# EAGLE board Specialist (EAGLE 6.4)
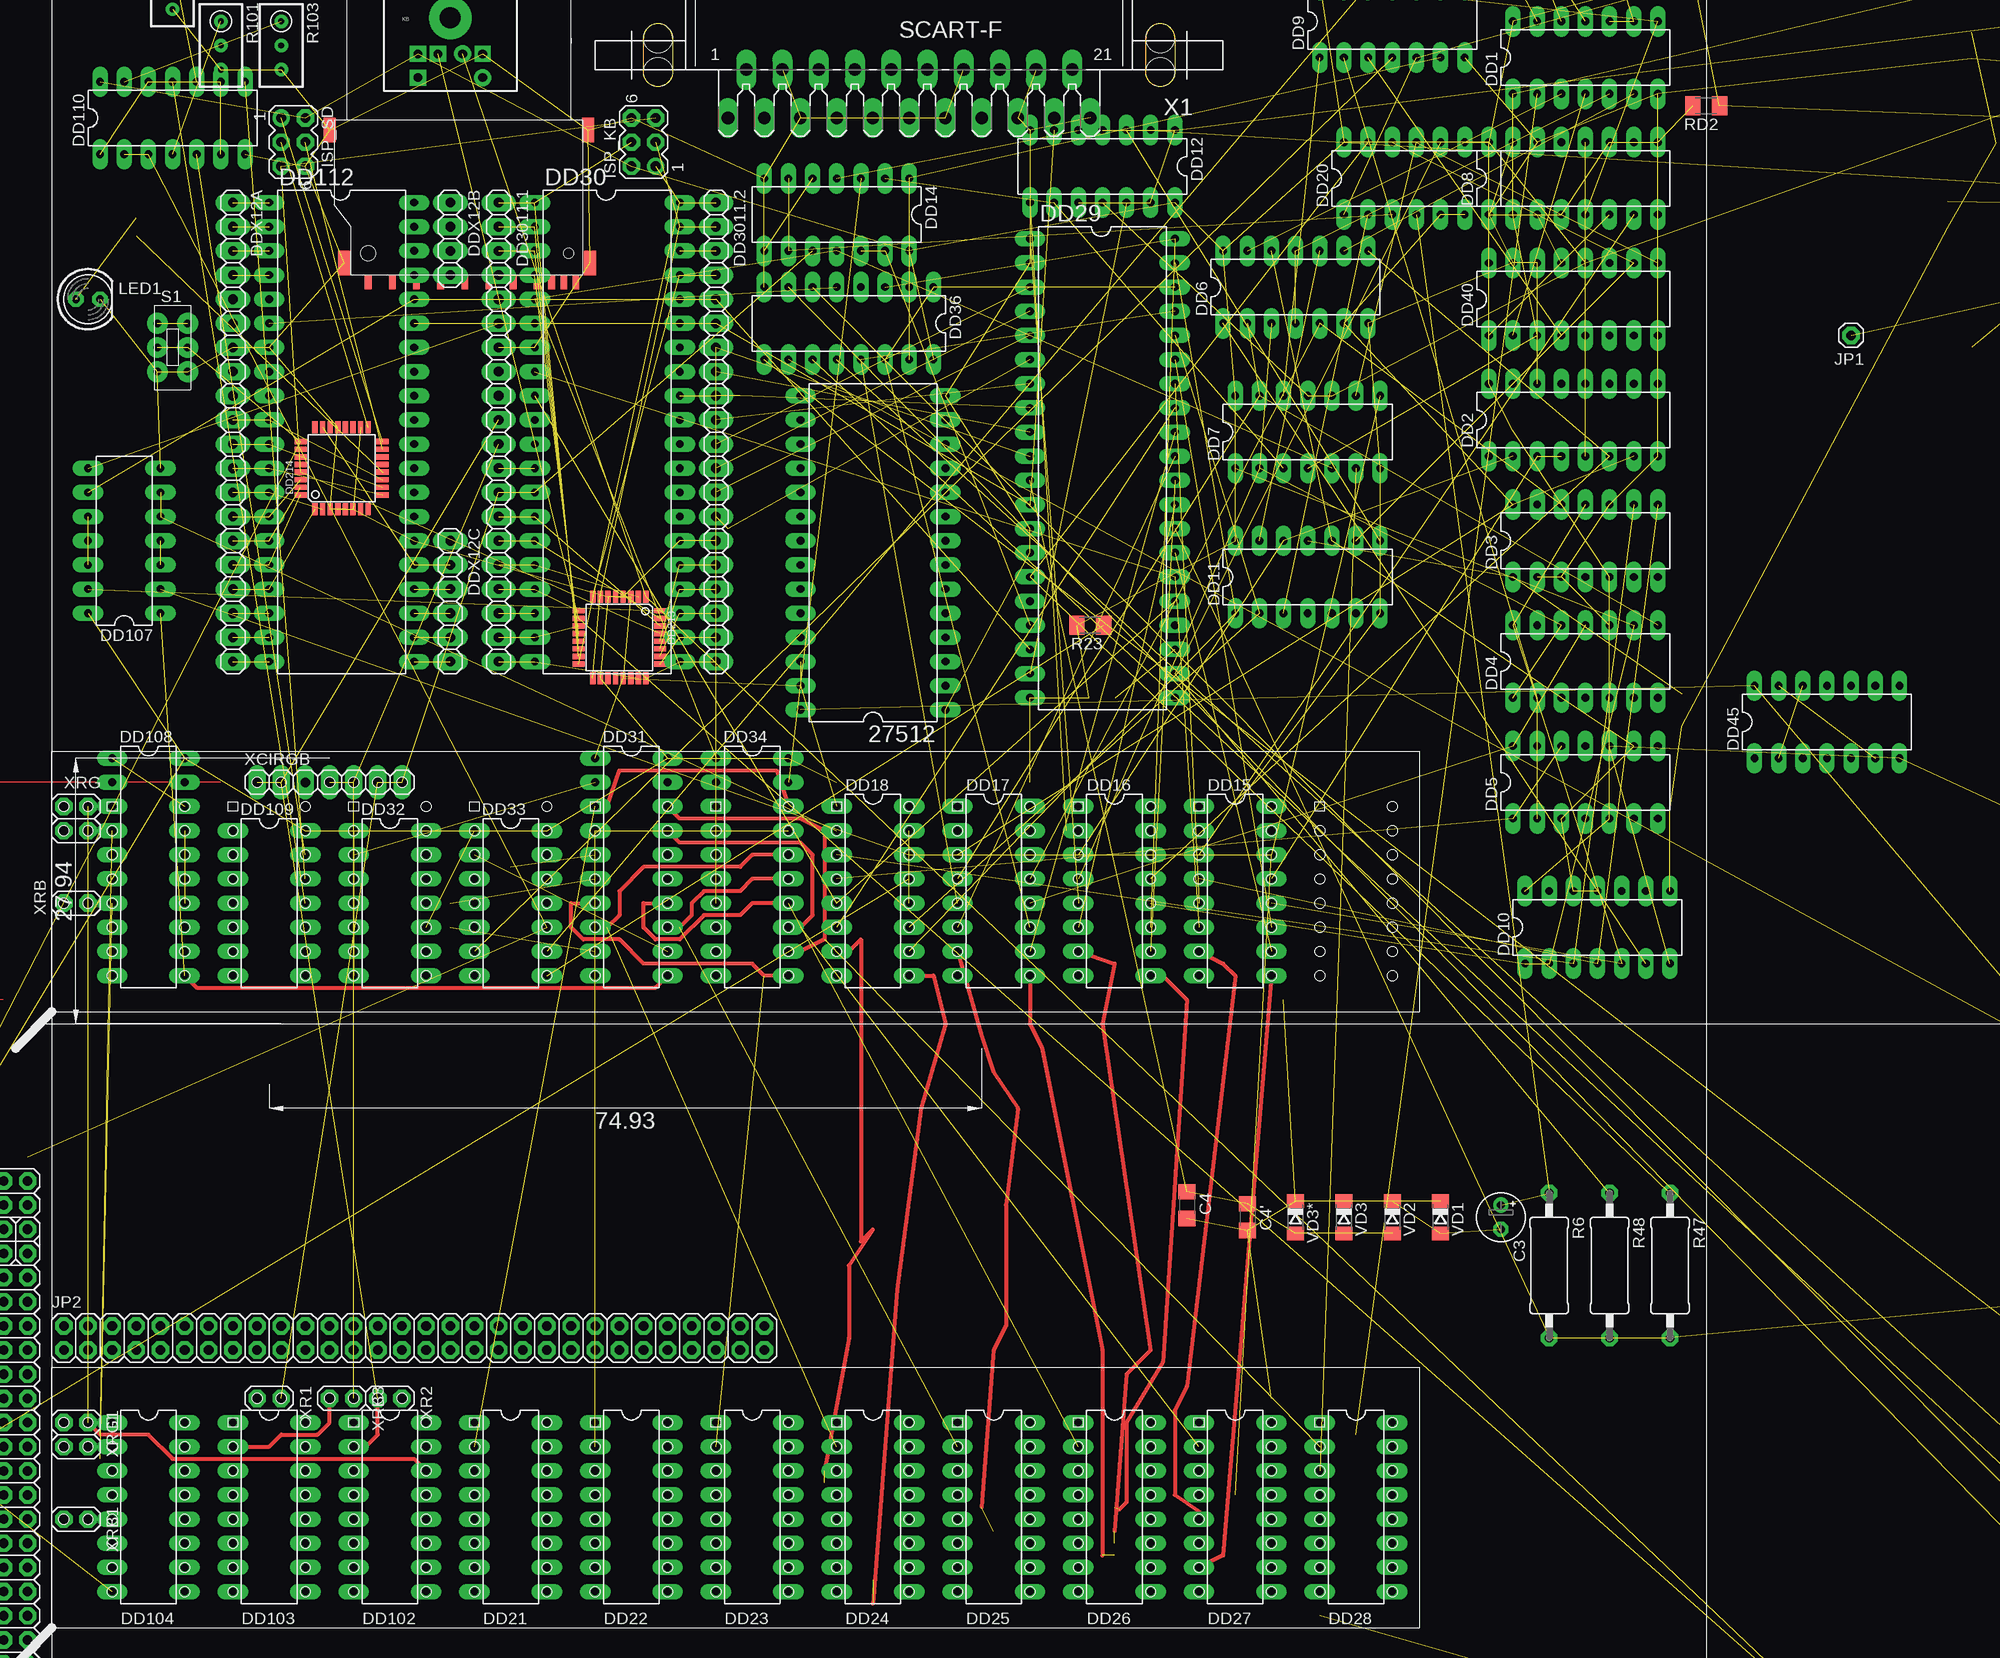
[diagram p9: board, top side]
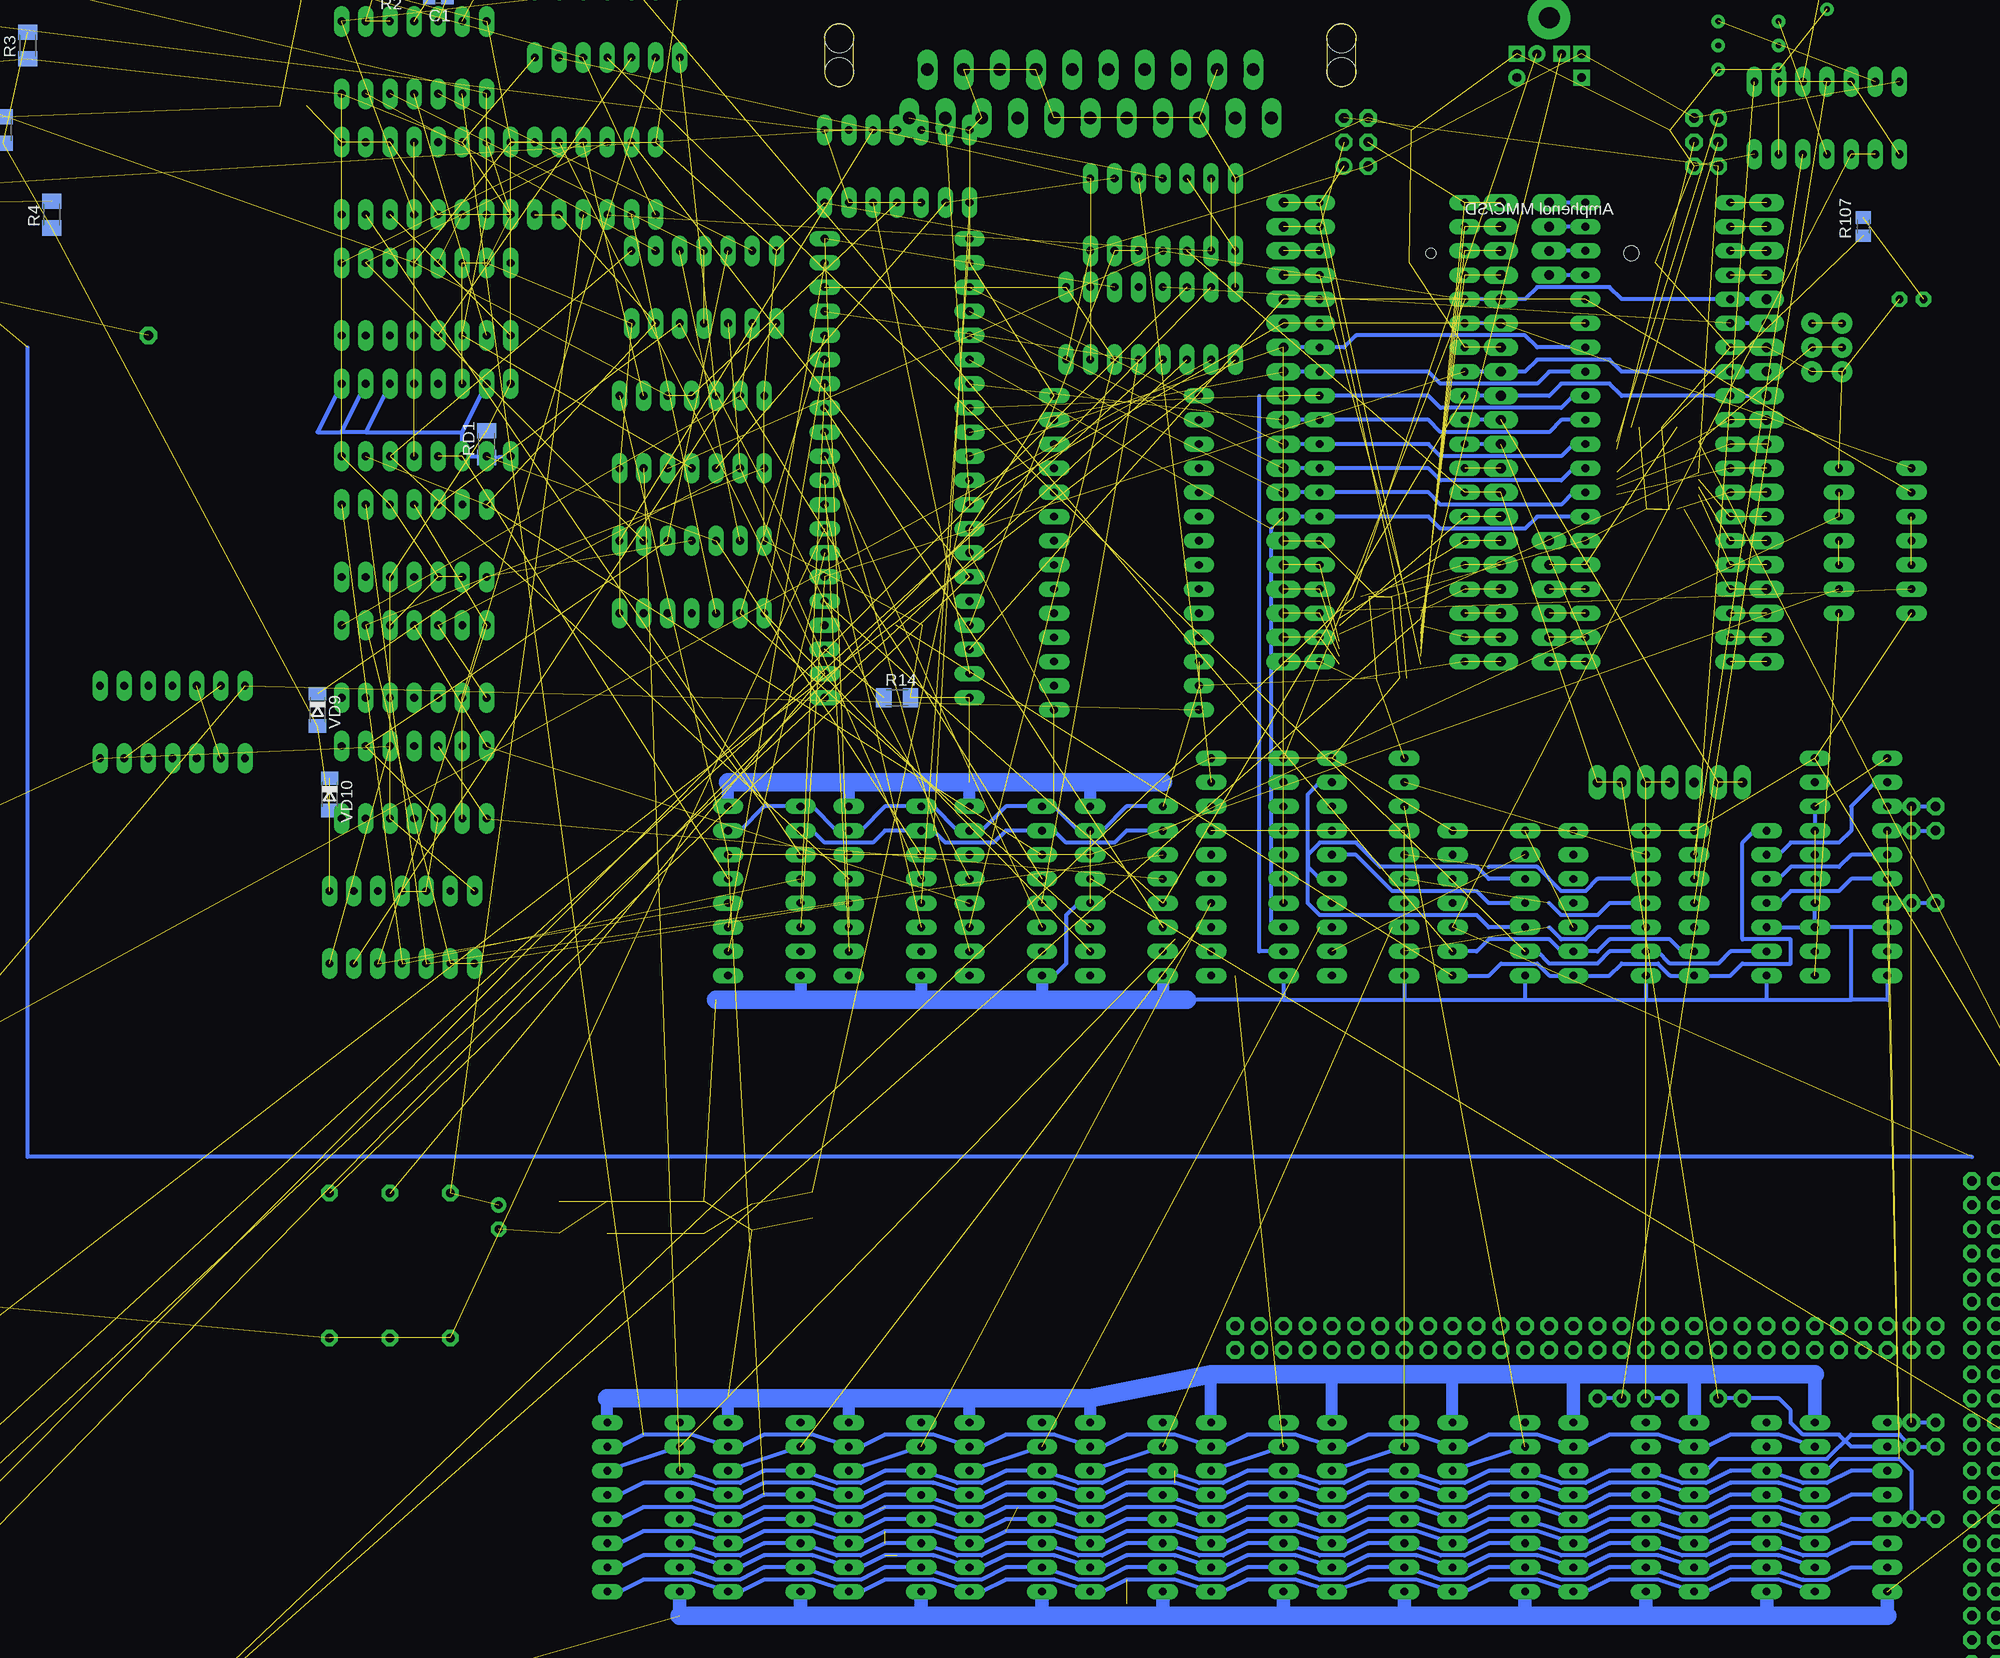
[diagram p10: board, bottom side, seen from below]

Size 55.88 x 6.6 mm. Coordinates in mm from the lower left corner, seen from the top.
Copper layers (1*16): Top 0.035mm / dielectric 1.5mm / Bottom 0.035mm
Design rules "speccy2007": minimum track width 10mil, minimum drill 24mil, track to track 8mil, track to pad 8mil, pad to pad 8mil, via to via 8mil, smd to smd 8mil, copper to edge 40mil, drill to drill 7mil, minimum pad ring 0.4mm, minimum via ring 8mil, stop-mask expansion 4mil, vias tented up to drill 0mil, thermal gap 10mil

## Footprints (pad centres in the part's own frame; a part is rotated, then mirrored left to right if it is on the bottom)
DIL28 = drill 0.813 long: 1 -16.51,-7.62; 2 -13.97,-7.62; 3 -11.43,-7.62; 4 -8.89,-7.62; 5 -6.35,-7.62; 6 -3.81,-7.62; 7 -1.27,-7.62; 8 1.27,-7.62; 9 3.81,-7.62; 10 6.35,-7.62; 11 8.89,-7.62; 12 11.43,-7.62; 13 13.97,-7.62; 14 16.51,-7.62; 15 16.51,7.62; 16 13.97,7.62; 17 11.43,7.62; 18 8.89,7.62; 19 6.35,7.62; 20 3.81,7.62; 21 1.27,7.62; 22 -1.27,7.62; 23 -3.81,7.62; 24 -6.35,7.62; 25 -8.89,7.62; 26 -11.43,7.62; 27 -13.97,7.62; 28 -16.51,7.62
C0805 = smd 1.3 x 1.5: 1 -0.95,0; 2 0.95,0
E2,5-5 = drill 0.813 pad 1.6: + -1.27,0 | drill 0.813 pad 1.6 octagon: - 1.27,0
C1206 = smd 1.6 x 1.8: 1 -1.4,0; 2 1.4,0
DIL14 = drill 0.813 long: 1 -7.62,-3.81; 2 -5.08,-3.81; 3 -2.54,-3.81; 4 0,-3.81; 5 2.54,-3.81; 6 5.08,-3.81; 7 7.62,-3.81; 8 7.62,3.81; 9 5.08,3.81; 10 2.54,3.81; 11 0,3.81; 12 -2.54,3.81; 13 -5.08,3.81; 14 -7.62,3.81
DIL16 = drill 0.813 long: 1 -8.89,-3.81; 2 -6.35,-3.81; 3 -3.81,-3.81; 4 -1.27,-3.81; 5 1.27,-3.81; 6 3.81,-3.81; 7 6.35,-3.81; 8 8.89,-3.81; 9 8.89,3.81; 10 6.35,3.81; 11 3.81,3.81; 12 1.27,3.81; 13 -1.27,3.81; 14 -3.81,3.81; 15 -6.35,3.81; 16 -8.89,3.81
DIL40 = drill 0.813 long: 1 -24.13,-7.62; 2 -21.59,-7.62; 3 -19.05,-7.62; 4 -16.51,-7.62; 5 -13.97,-7.62; 6 -11.43,-7.62; 7 -8.89,-7.62; 8 -6.35,-7.62; 9 -3.81,-7.62; 10 -1.27,-7.62; 11 1.27,-7.62; 12 3.81,-7.62; 13 6.35,-7.62; 14 8.89,-7.62; 15 11.43,-7.62; 16 13.97,-7.62; 17 16.51,-7.62; 18 19.05,-7.62; 19 21.59,-7.62; 20 24.13,-7.62; 21 24.13,7.62; 22 21.59,7.62; 23 19.05,7.62; 24 16.51,7.62; 25 13.97,7.62; 26 11.43,7.62; 27 8.89,7.62; 28 6.35,7.62; 29 3.81,7.62; 30 1.27,7.62; 31 -1.27,7.62; 32 -3.81,7.62; 33 -6.35,7.62; 34 -8.89,7.62; 35 -11.43,7.62; 36 -13.97,7.62; 37 -16.51,7.62; 38 -19.05,7.62; 39 -21.59,7.62; 40 -24.13,7.62
DIL20 = drill 0.813 long: 1 -11.43,-3.81; 2 -8.89,-3.81; 3 -6.35,-3.81; 4 -3.81,-3.81; 5 -1.27,-3.81; 6 1.27,-3.81; 7 3.81,-3.81; 8 6.35,-3.81; 9 8.89,-3.81; 10 11.43,-3.81; 11 11.43,3.81; 12 8.89,3.81; 13 6.35,3.81; 14 3.81,3.81; 15 1.27,3.81; 16 -1.27,3.81; 17 -3.81,3.81; 18 -6.35,3.81; 19 -8.89,3.81; 20 -11.43,3.81
DIL24 = drill 0.813 long: 1 -13.97,-7.62; 2 -11.43,-7.62; 3 -8.89,-7.62; 4 -6.35,-7.62; 5 -3.81,-7.62; 6 -1.27,-7.62; 7 1.27,-7.62; 8 3.81,-7.62; 9 6.35,-7.62; 10 8.89,-7.62; 11 11.43,-7.62; 12 13.97,-7.62; 13 13.97,7.62; 14 11.43,7.62; 15 8.89,7.62; 16 6.35,7.62; 17 3.81,7.62; 18 1.27,7.62; 19 -1.27,7.62; 20 -3.81,7.62; 21 -6.35,7.62; 22 -8.89,7.62; 23 -11.43,7.62; 24 -13.97,7.62
TQFP32-08 = smd 1.27 x 0.559: 1 -4.293,2.8; 2 -4.293,2; 3 -4.293,1.2; 4 -4.293,0.4; 5 -4.293,-0.4; 6 -4.293,-1.2; 7 -4.293,-2; 8 -4.293,-2.8; 17 4.293,-2.8; 18 4.293,-2; 19 4.293,-1.2; 20 4.293,-0.4; 21 4.293,0.4; 22 4.293,1.2; 23 4.293,2; 24 4.293,2.8 | smd 0.559 x 1.27: 9 -2.8,-4.293; 10 -2,-4.293; 11 -1.2,-4.293; 12 -0.4,-4.293; 13 0.4,-4.293; 14 1.2,-4.293; 15 2,-4.293; 16 2.8,-4.293; 25 2.8,4.293; 26 2,4.293; 27 1.2,4.293; 28 0.4,4.293; 29 -0.4,4.293; 30 -1.2,4.293; 31 -2,4.293; 32 -2.8,4.293
1X20 = drill 1.016 long: 1 -24.13,0; 2 -21.59,0; 3 -19.05,0; 4 -16.51,0; 5 -13.97,0; 6 -11.43,0; 7 -8.89,0; 8 -6.35,0; 9 -3.81,0; 10 -1.27,0; 11 1.27,0; 12 3.81,0; 13 6.35,0; 14 8.89,0; 15 11.43,0; 16 13.97,0; 17 16.51,0; 18 19.05,0; 19 21.59,0; 20 24.13,0
1X04 = drill 1.016 long: 1 -3.81,0; 2 -1.27,0; 3 1.27,0; 4 3.81,0
1X06 = drill 1.016 long: 1 -6.35,0; 2 -3.81,0; 3 -1.27,0; 4 1.27,0; 5 3.81,0; 6 6.35,0
MA03-2 = drill 1.016: 1 -2.54,-1.27 | drill 1.016 octagon: 2 -2.54,1.27; 3 0,-1.27; 4 0,1.27; 5 2.54,-1.27; 6 2.54,1.27
SDCMF-10915W010 = smd 0.711 x 1.422: 1 7.366,13.462; 2 4.826,13.462; 3 2.286,13.462; 4 -0.254,13.462; 5 -2.794,13.462; 6 -5.334,13.462; 7 -7.874,13.462; 8 -9.398,13.462; 9 9.906,13.462; 10 -11.938,13.462; 11 -10.668,13.462 | smd 1.27 x 2.54: M1 12.43,11.43; M2 13.97,-2.54; M3 -13.208,-2.54; M4 -13.446,11.43 | hole 1.6: 9.906,10.414 | hole 1.1: -11.176,10.414
1X01 = drill 1.016 octagon: 1 0,0
2X30 = drill 1.016 octagon: 1 -38.1,-1.27; 2 -38.1,1.27; 3 -35.56,-1.27; 4 -35.56,1.27; 5 -33.02,-1.27; 6 -33.02,1.27; 7 -30.48,-1.27; 8 -30.48,1.27; 9 -27.94,-1.27; 10 -27.94,1.27; 11 -25.4,-1.27; 12 -25.4,1.27; 13 -22.86,-1.27; 14 -22.86,1.27; 15 -20.32,-1.27; 16 -20.32,1.27; 17 -17.78,-1.27; 18 -17.78,1.27; 19 -15.24,-1.27; 20 -15.24,1.27; 21 -12.7,-1.27; 22 -12.7,1.27; 23 -10.16,-1.27; 24 -10.16,1.27; 25 -7.62,-1.27; 26 -7.62,1.27; 27 -5.08,-1.27; 28 -5.08,1.27; 29 -2.54,-1.27; 30 -2.54,1.27; 31 0,-1.27; 32 0,1.27; 33 2.54,-1.27; 34 2.54,1.27; 35 5.08,-1.27; 36 5.08,1.27; 37 7.62,-1.27; 38 7.62,1.27; 39 10.16,-1.27; 40 10.16,1.27; 41 12.7,-1.27; 42 12.7,1.27; 43 15.24,-1.27; 44 15.24,1.27; 45 17.78,-1.27; 46 17.78,1.27; 47 20.32,-1.27; 48 20.32,1.27; 49 22.86,-1.27; 50 22.86,1.27; 51 25.4,-1.27; 52 25.4,1.27; 53 27.94,-1.27; 54 27.94,1.27; 55 30.48,-1.27; 56 30.48,1.27; 57 33.02,-1.27; 58 33.02,1.27; 59 35.56,-1.27; 60 35.56,1.27
2X03 = drill 1.016 octagon: 1 -2.54,-1.27; 2 -2.54,1.27; 3 0,-1.27; 4 0,1.27; 5 2.54,-1.27; 6 2.54,1.27
MINI-DIN6 = drill 0.9 pad 1.676 square: 1 -1.3,-8.5; 3 -3.4,-8.5; 4 3.4,-8.5; 5 -3.4,-11 | drill 0.9 pad 1.778: 2 1.3,-8.5; 6 3.4,-11 | drill 2.2 pad 4.5: GND 0,-4.7
LED5MM = drill 0.813 octagon: A -1.27,0; K 1.27,0
M1206 = smd 1.6 x 2: 1 -1.4,0; 2 1.4,0
0411/15 = drill 0.914 octagon: 1 -7.62,0; 2 7.62,0
M0805 = smd 1.3 x 1.6: 1 -0.95,0; 2 0.95,0
RTRIM3296W = drill 0.61: 1 0,-2.54; 2 0,0; 3 0,2.54
SWITCH9X4 = drill 0.8 pad 2.184: 10 -1.587,0; 11 -1.587,2.54; 12 -1.587,-2.54; 20 1.587,0; 21 1.587,2.54; 22 1.587,-2.54
NANOITXPCB = hole 3.8: 3.25,116.75; 113.65,86.95; 116.75,3; 2.75,3
SOD80C = smd 1.4 x 1.8: A 1.7,0; C -1.7,0
DO41-10 = drill 1.118: A 5.08,0; C -5.08,0
SCART-F = drill 1.321 long: 1 19.05,5.08; 2 17.145,0; 3 15.24,5.08; 4 13.335,0; 5 11.43,5.08; 6 9.525,0; 7 7.62,5.08; 8 5.715,0; 9 3.81,5.08; 10 1.905,0; 11 0,5.08; 12 -1.905,0; 13 -3.81,5.08; 14 -5.715,0; 15 -7.62,5.08; 16 -9.525,0; 17 -11.43,5.08; 18 -13.335,0; 19 -15.24,5.08; 20 -17.145,0; 21 -19.05,5.08 | hole 3.023: 26.416,0.254; 26.416,-3.302; -26.416,0.254; -26.416,-3.302
1X07 = drill 1.016 long: 1 -7.62,0; 2 -5.08,0; 3 -2.54,0; 4 0,0; 5 2.54,0; 6 5.08,0; 7 7.62,0
2X01 = drill 1.016 octagon: 1 -1.27,-1.27; 2 -1.27,1.27
2X02 = drill 1.016 octagon: 1 -1.27,-1.27; 2 -1.27,1.27; 3 1.27,-1.27; 4 1.27,1.27
HC49/S = drill 0.813: 1 -2.413,0; 2 2.413,0

## Placement (x,y rotation side)
27512  [DIL28]  24.13,-49.02 90 top  (outside the outline)
C1  300  [C0805]  96.52,9.4 180 bottom  (outside the outline)
C3  2m2  [E2,5-5]  90.17,-118.87 270 top  (outside the outline)
C4  [C1206]  57.15,-117.6 270 top  (outside the outline)
C4'  [C1206]  63.5,-118.87 270 top  (outside the outline)
C5  100  [C0805]  154.94,1.78 0 bottom  (outside the outline)
C6  68  [C0805]  154.94,14.48 0 bottom  (outside the outline)
C7  100m  [E2,5-5]  156.21,-10.92 0 top  (outside the outline)
C10  2m2  [E2,5-5]  148.59,-21.08 0 top  (outside the outline)
C11  22n  [C0805]  147.32,-12.19 0 top  (outside the outline)
DD1  К155ЛН1  [DIL14]  99.06,3.05 0 top  (outside the outline)
DD2  К155ИЕ7  [DIL16]  97.79,-35.05 0 top  (outside the outline)
DD3  К155ИЕ5  [DIL14]  99.06,-47.75 0 top  (outside the outline)
DD4  К155ИЕ5  [DIL14]  99.06,-60.45 0 top  (outside the outline)
DD5  К155ИЕ5  [DIL14]  99.06,-73.15 0 top  (outside the outline)
DD6  К155ЛЕ1  [DIL14]  68.58,-21.08 0 top  (outside the outline)
DD7  К155ЛА4  [DIL14]  69.85,-36.32 0 top  (outside the outline)
DD8  К155ИЕ7  [DIL16]  97.79,-9.65 0 top  (outside the outline)
DD9  К155ЛН1  [DIL14]  78.74,6.86 0 top  (outside the outline)
DD10  К155ЛА2  [DIL14]  100.33,-88.39 0 top  (outside the outline)
DD11  К155ЛА3  [DIL14]  69.85,-51.56 0 top  (outside the outline)
DD12  К155ТМ2  [DIL14]  48.26,-8.38 180 top  (outside the outline)
DD14  К155ЛА3  [DIL14]  20.32,-13.46 180 top  (outside the outline)
DD15  К155КП2  [DIL16]  62.23,-84.58 270 top  (outside the outline)
DD16  К155КП2  [DIL16]  49.53,-84.58 270 top  (outside the outline)
DD17  К155КП2  [DIL16]  36.83,-84.58 270 top  (outside the outline)
DD18  К155КП2  [DIL16]  24.13,-84.58 270 top  (outside the outline)
DD19  К155ЛП10  [DIL16]  219.71,-150.62 180 top  (outside the outline)
DD20  К155ЛА8  [DIL14]  81.28,-9.65 0 top  (outside the outline)
DD21  КР565РУ5  [DIL16]  -13.97,-149.35 270 top  (outside the outline)
DD22  КР565РУ5  [DIL16]  -1.27,-149.35 270 top  (outside the outline)
DD23  КР565РУ5  [DIL16]  11.43,-149.35 270 top  (outside the outline)
DD24  КР565РУ5  [DIL16]  24.13,-149.35 270 top  (outside the outline)
DD25  КР565РУ5  [DIL16]  36.83,-149.35 270 top  (outside the outline)
DD26  КР565РУ5  [DIL16]  49.53,-149.35 270 top  (outside the outline)
DD27  КР565РУ5  [DIL16]  62.23,-149.35 270 top  (outside the outline)
DD28  КР565РУ5  [DIL16]  74.93,-149.35 270 top  (outside the outline)
DD29  КР580ВМ80  [DIL40]  48.26,-40.13 270 top  (outside the outline)
DD30  КР580ВВ55  [DIL40]  -3.81,-36.32 270 top  (outside the outline)
DD31  К555ИР22  [DIL20]  -1.27,-82.04 270 top  (outside the outline)
DD32  К555ИР16  [DIL14]  -26.67,-85.85 270 top  (outside the outline)
DD33  К555ИР16  [DIL14]  -13.97,-85.85 270 top  (outside the outline)
DD34  К555АП6  [DIL20]  11.43,-82.04 270 top  (outside the outline)
DD36  К155ИД4  [DIL16]  21.59,-24.89 180 top  (outside the outline)
DD37  К573РФ2  [DIL24]  171.45,-141.73 90 top  (outside the outline)
DD38  К573РФ2  [DIL24]  173.99,-107.44 90 top  (outside the outline)
DD39  К573РФ4  [DIL28]  194.31,-141.73 270 top  (outside the outline)
DD40  К155ИД4  [DIL16]  97.79,-22.35 0 top  (outside the outline)
DD45  К555ИЕ19  [DIL14]  124.46,-66.8 0 top  (outside the outline)
DD102  КР565РУ5  [DIL16]  -26.67,-149.35 270 top  (outside the outline)
DD103  КР565РУ5  [DIL16]  -39.37,-149.35 270 top  (outside the outline)
DD104  КР565РУ5  [DIL16]  -52.07,-149.35 270 top  (outside the outline)
DD107  К155ЛЕ1  [DIL14]  -54.61,-47.75 90 top  (outside the outline)
DD108  К555ИР22  [DIL20]  -52.07,-82.04 270 top  (outside the outline)
DD109  К555ИР16  [DIL14]  -39.37,-85.85 270 top  (outside the outline)
DD110  К155ЛЕ1  [DIL14]  -49.53,-3.3 0 top  (outside the outline)
DD112  КР580ВВ55  [DIL40]  -31.75,-36.32 270 top  (outside the outline)
DD213  MEGA8-AI  [TQFP32-08]  -2.54,-57.91 270 top  (outside the outline)
DD214  MEGA8-AI  [TQFP32-08]  -31.75,-40.13 90 top  (outside the outline)
DD3011.1  [1X20]  -15.24,-36.32 270 top  (outside the outline)
DD3011.2  [1X20]  7.62,-36.32 270 top  (outside the outline)
DDX12A  [1X20]  -43.18,-36.32 270 top  (outside the outline)
DDX12B  [1X04]  -20.32,-16 270 top  (outside the outline)
DDX12C  [1X06]  -20.32,-54.1 270 top  (outside the outline)
ISP_KB  [MA03-2]  0,-5.84 90 top  (outside the outline)
ISP_SD  [MA03-2]  -36.83,-5.84 270 top  (outside the outline)
J1  [SDCMF-10915W010]  -19.05,-7.11 180 top  (outside the outline)
JP1  [1X01]  127,-26.16 180 top  (outside the outline)
JP2  [2X30]  -22.86,-131.57 0 top  (outside the outline)
JP4  [2X30]  -66.04,-150.62 90 top  (outside the outline)
JP8  [2X03]  -67.31,-121.41 0 top  (outside the outline)
KB  MINI-DIN6  [MINI-DIN6]  -20.32,11.94 0 top  (outside the outline)
LED1  [LED5MM]  -58.42,-22.35 0 top  (outside the outline)
R1  390  [M1206]  92.71,11.94 180 bottom  (outside the outline)
R2  390  [M1206]  101.6,10.67 180 bottom  (outside the outline)
R3  200  [M1206]  139.7,4.32 90 bottom  (outside the outline)
R4  150  [M1206]  137.16,-13.46 90 bottom  (outside the outline)
R5  430*  [M1206]  142.24,-4.57 90 bottom  (outside the outline)
R6  390r  [0411/15]  95.25,-123.95 270 top  (outside the outline)
R7''  4k7  [M0805]  -69.85,-104.9 0 top  (outside the outline)
R9  2k  [M1206]  195.58,-186.18 270 bottom  (outside the outline)
R10  2k  [M1206]  156.21,-4.57 0 bottom  (outside the outline)
R11  2k  [M1206]  156.21,8.13 0 bottom  (outside the outline)
R11B  2k  [M1206]  -73.66,-145.54 0 top  (outside the outline)
R13  2k  [M1206]  111.76,11.94 180 top  (outside the outline)
R14  2k  [M1206]  48.26,-64.26 0 bottom  (outside the outline)
R23  2k  [M1206]  46.99,-56.64 180 top  (outside the outline)
R47  390r 0.5w  [0411/15]  107.95,-123.95 270 top  (outside the outline)
R48  390r 0.5w  [0411/15]  101.6,-123.95 270 top  (outside the outline)
R101  [RTRIM3296W]  -44.45,4.32 180 top  (outside the outline)
R102  [RTRIM3296W]  -49.53,10.67 180 top  (outside the outline)
R103  [RTRIM3296W]  -38.1,4.32 180 top  (outside the outline)
R105  4k7  [M0805]  129.54,-177.29 0 bottom  (outside the outline)
R106  4k7  [M0805]  130.81,-178.56 0 bottom  (outside the outline)
R107  560  [M0805]  -53.34,-14.73 90 bottom  (outside the outline)
RD1  2k  [M1206]  91.44,-37.59 90 bottom  (outside the outline)
RD2  2k  [M1206]  111.76,-2.03 180 top  (outside the outline)
S1  TapeOn  [SWITCH9X4]  -49.53,-27.43 0 top  (outside the outline)
U$1  [RAM3+8]  -62.23,-102.36 0 top  (outside the outline)
U$2  [NANOITXPCB]  274.32,-107.44 0 top  (outside the outline)
U$3  [RAM3+8]  -62.23,-167.13 0 top  (outside the outline)
VD1  [SOD80C]  83.82,-118.87 270 top  (outside the outline)
VD2  [SOD80C]  78.74,-118.87 270 top  (outside the outline)
VD3  [SOD80C]  73.66,-118.87 270 top  (outside the outline)
VD3*  [SOD80C]  68.58,-118.87 270 top  (outside the outline)
VD4  [SOD80C]  175.26,-186.18 270 bottom  (outside the outline)
VD5  [SOD80C]  180.34,-186.18 270 bottom  (outside the outline)
VD6  [SOD80C]  185.42,-186.18 270 bottom  (outside the outline)
VD7  [SOD80C]  190.5,-186.18 270 bottom  (outside the outline)
VD8  1N4004  [DO41-10]  148.59,-122.68 90 top  (outside the outline)
VD9  [SOD80C]  109.22,-65.53 270 bottom  (outside the outline)
VD10  [SOD80C]  107.95,-74.42 270 bottom  (outside the outline)
X1  SCART-F  [SCART-F]  27.94,1.78 180 top
XCIRGB  [1X07]  -33.02,-73.15 0 top  (outside the outline)
XR1  [2X01]  -39.37,-139.19 270 top  (outside the outline)
XR2  [2X01]  -26.67,-139.19 270 top  (outside the outline)
XRB  [2X01]  -59.69,-84.58 90 top  (outside the outline)
XRB1  [2X01]  -59.69,-151.89 270 top  (outside the outline)
XRB3  [2X01]  -31.75,-139.19 270 top  (outside the outline)
XRG  [2X02]  -59.69,-76.96 270 top  (outside the outline)
XRG1  [2X02]  -59.69,-141.73 270 top  (outside the outline)
Z1  8000  [HC49/S]  99.06,14.48 0 top  (outside the outline)

## Tracks (layer width: path | path; a pad name or v marks a point on that pad's centre or on a via)
!CAS  (1 unrouted)
  Bottom 0.406: DD28.15 77.47,-143 74.93,-141.73 69.85,-141.73 DD27.15 64.77,-143 62.23,-141.73 57.15,-141.73 DD26.15 52.07,-143 49.53,-141.73 44.45,-141.73 DD25.15 39.37,-143 36.83,-141.73 31.75,-141.73 DD24.15 26.67,-143 24.13,-141.73 19.05,-141.73 DD23.15 13.97,-143 11.43,-141.73 6.35,-141.73 DD22.15 1.27,-143 -1.27,-141.73 -6.35,-141.73 DD21.15 -11.43,-143 -13.97,-141.73 -19.05,-141.73 DD102.15 -24.13,-143 -26.67,-141.73 -31.75,-141.73 DD103.15 -36.83,-143 -39.37,-141.73 -44.45,-141.73 DD104.15
!G19B  (1 unrouted)
!G19T  (2 unrouted)
!OE!DD37  (1 unrouted)
!OE!DD38  (1 unrouted)
!RAS  (6 unrouted)
  Bottom 0.406: DD28.4 67.31,-149.35 64.77,-149.35 62.23,-148.08 DD27.4 54.61,-149.35 52.07,-149.35 49.53,-148.08 DD26.4 41.91,-149.35 39.37,-149.35 36.83,-148.08 DD25.4 29.21,-149.35 26.67,-149.35 24.13,-148.08 DD24.4 16.51,-149.35 13.97,-149.35 11.43,-148.08 DD23.4 3.81,-149.35 1.27,-149.35 -1.27,-148.08 DD22.4 -8.89,-149.35 -11.43,-149.35 -13.97,-148.08 DD21.4 -21.59,-149.35 -24.13,-149.35 -26.67,-148.08 DD102.4 -34.29,-149.35 -36.83,-149.35 -39.37,-148.08 DD103.4 -46.99,-149.35 -49.53,-149.35 -52.07,-148.08 DD104.4
!RD  (3 unrouted)
  Bottom 0.406: DDX12A.5 DD112.5 -27.94,-22.35 -26.67,-21.08 -19.05,-21.08 -17.78,-22.35 DD3011.1.5 DD30.5
!RES  (1 unrouted)
!RESIN  (3 unrouted)
!U6  (1 unrouted)
  Bottom 0.406: DDX12A.6 DD112.6
!U7  (1 unrouted)
  Bottom 0.406: DD3011.1.6 DD30.6
!WE  (1 unrouted)
  Bottom 0.406: DD28.3 67.31,-146.81 64.77,-146.81 62.23,-145.54 DD27.3 54.61,-146.81 52.07,-146.81 49.53,-145.54 DD26.3 41.91,-146.81 39.37,-146.81 36.83,-145.54 DD25.3 29.21,-146.81 26.67,-146.81 24.13,-145.54 DD24.3 16.51,-146.81 13.97,-146.81 11.43,-145.54 DD23.3 3.81,-146.81 1.27,-146.81 -1.27,-145.54 DD22.3 -8.89,-146.81 -11.43,-146.81 -13.97,-145.54 DD21.3 -21.59,-146.81 -24.13,-146.81 -26.67,-145.54 DD102.3 -34.29,-146.81 -36.83,-146.81 -39.37,-145.54 DD103.3 -46.99,-146.81 -49.53,-146.81 -52.07,-145.54 DD104.3
!WR  (4 unrouted)
+5V  (57 unrouted)
  Bottom 1.27: DD18.16 27.94,-73.15 | DD17.16 40.64,-73.15 | DD16.16 53.34,-73.15 | DD15.16 66.04,-73.15
  Bottom 1.422: DD104.8 -55.88,-160.78 | DD103.8 -43.18,-160.78 | DD102.8 -30.48,-160.78 | DD21.8 -17.78,-160.78 | DD22.8 -5.08,-160.78 | DD23.8 7.62,-160.78 | DD24.8 20.32,-160.78 | DD25.8 33.02,-160.78 | DD26.8 45.72,-160.78 | DD27.8 58.42,-160.78 | DD28.8 71.12,-160.78
  Bottom 1.93: 71.12,-160.78 58.42,-160.78 45.72,-160.78 33.02,-160.78 20.32,-160.78 7.62,-160.78 -5.08,-160.78 -17.78,-160.78 -30.48,-160.78 -43.18,-160.78 -55.88,-160.78 | 20.32,-73.15 27.94,-73.15 40.64,-73.15 53.34,-73.15 66.04,-73.15
+12V  (4 unrouted)
-5V  (5 unrouted)
A0  (2 unrouted)
  Bottom 0.406: DDX12A.9 DD112.9 -27.94,-32.51 -26.67,-31.24 -21.59,-31.24 -20.32,-32.51 DD3011.1.9 DD30.9
A1  (2 unrouted)
  Bottom 0.406: DD30.8 DD3011.1.8 -17.78,-29.97 -19.05,-28.7 -26.67,-28.7 -27.94,-29.97 DD112.8 DDX12A.8
A2  (1 unrouted)
A3  (1 unrouted)
A4  (1 unrouted)
A5  (1 unrouted)
A6  (1 unrouted)
A7  (1 unrouted)
A8  (1 unrouted)
A9  (1 unrouted)
A10  (1 unrouted)
A11  (2 unrouted)
A12  (2 unrouted)
A13  (3 unrouted)
A14  (2 unrouted)
A15  (2 unrouted)
B  (5 unrouted)
  Bottom 0.406: XR1.2 XR1.1 -44.45,-137.92 -45.72,-139.19 -45.72,-140.46 -46.99,-141.73 -50.8,-141.73 -52.07,-143 DD104.2
BO  (1 unrouted)
  Bottom 0.406: XRB.2 XRB.1 DD108.7 | DD104.14 -49.53,-145.54 -50.8,-144.27 -57.15,-144.27 -58.42,-145.54 XRB1.2 XRB1.1
CLK  (1 unrouted)
  Bottom 0.406: DD109.9 -34.29,-90.93 -33.02,-89.66 -26.67,-89.66 -25.4,-90.93 DD32.9 -21.59,-90.93 -20.32,-89.66 -13.97,-89.66 -12.7,-90.93 DD33.9
CRG  (1 unrouted)
  Top 0.406: DD108.11 -46.99,-94.74 1.27,-94.74 DD31.11
D0  (2 unrouted)
  Bottom 0.406: DD112.34 -19.05,-27.43 -17.78,-26.16 0,-26.16 1.27,-27.43 DD30.34 DD3011.2.7
D1  (2 unrouted)
  Bottom 0.406: DD112.33 -20.32,-29.97 -19.05,-31.24 -8.89,-31.24 -7.62,-29.97 DD30.33 DD3011.2.8
D2  (3 unrouted)
  Bottom 0.406: DD112.32 -22.86,-32.51 -21.59,-33.78 -8.89,-33.78 -7.62,-32.51 DD30.32 | DD34.9 10.16,-90.93 10.16,-32.51
D3  (2 unrouted)
  Bottom 0.406: DD112.31 -21.59,-35.05 -20.32,-36.32 -8.89,-36.32 -7.62,-35.05 DD30.31 DD3011.2.10
D4  (2 unrouted)
  Bottom 0.406: DD112.30 -22.86,-37.59 -21.59,-38.86 -8.89,-38.86 -7.62,-37.59 DD30.30 DD3011.2.11
D5  (2 unrouted)
  Bottom 0.406: DD112.29 -22.86,-40.13 -21.59,-41.4 -8.89,-41.4 -7.62,-40.13 DD30.29 DD3011.2.12
D6  (2 unrouted)
  Bottom 0.406: DD112.28 -22.86,-42.67 -21.59,-43.94 -8.89,-43.94 -7.62,-42.67 DD30.28 DD3011.2.13
D7  (2 unrouted)
  Bottom 0.406: DD112.27 -19.05,-45.21 -17.78,-46.48 -8.89,-46.48 -7.62,-45.21 DD30.27 DD3011.2.14 | DD34.8 8.89,-88.39 8.89,-46.48
DD9DD14  (3 unrouted)
F1  (2 unrouted)
F2  (2 unrouted)
G  (3 unrouted)
  Top 0.406: DD103.2 -39.37,-143 -38.1,-141.73 -34.29,-141.73 -33.02,-140.46 XRB3.1
  Bottom 0.406: DD3011.1.11 DD30.11 | XRB3.1 XRB3.2
G1  (1 unrouted)
G2  (1 unrouted)
G3  (2 unrouted)
G4  (2 unrouted)
G5  (5 unrouted)
G6  (2 unrouted)
G7  (2 unrouted)
G8  (2 unrouted)
G9  (3 unrouted)
G10  (4 unrouted)
G11  (4 unrouted)
G12  (3 unrouted)
G13  (2 unrouted)
G14  (2 unrouted)
G15  (4 unrouted)
G16  (6 unrouted)
G17  (2 unrouted)
G18  (6 unrouted)
G19  (3 unrouted)
  Bottom 0.406: DD18.2 24.13,-78.23 25.4,-79.5 30.48,-79.5 31.75,-78.23 DD17.2 36.83,-78.23 38.1,-79.5 43.18,-79.5 44.45,-78.23 DD16.2 49.53,-78.23 50.8,-79.5 55.88,-79.5 57.15,-78.23 DD15.2
GND  (82 unrouted)
  Bottom 0.406: DD18.1 24.13,-75.69 26.67,-78.23 DD18.15 29.21,-78.23 31.75,-75.69 DD17.1 36.83,-75.69 39.37,-78.23 DD17.15 41.91,-78.23 44.45,-75.69 DD16.1 49.53,-75.69 52.07,-78.23 DD16.15 54.61,-78.23 57.15,-75.69 DD15.1 62.23,-75.69 64.77,-78.23 DD15.15 | DD18.12 29.21,-85.85 30.48,-87.12 30.48,-92.2 31.75,-93.47 DD17.8 | -43.18,-96.01 DD109.7 | DD109.5 DD108.13 | DD108.13 DD108.14 | DD108.8 -52.07,-88.39 | -52.07,-88.39 DD108.13 | DD32.7 -30.48,-96.01 | -30.48,-96.01 -43.18,-96.01 | DD33.7 -17.78,-96.01 | -17.78,-96.01 -30.48,-96.01 | DD31.10 -5.08,-96.01 | -5.08,-96.01 -17.78,-96.01 | -43.18,-96.01 -52.07,-96.01 | -52.07,-96.01 -52.07,-88.39 | DD108.10 -55.88,-96.01 -52.07,-96.01 | DD108.18 DD108.17 | DD34.10 7.62,-96.01 | 7.62,-96.01 -5.08,-96.01 | 7.62,-96.01 17.78,-96.01
  Bottom 1.27: DD21.16 -10.16,-135.38 | DD22.16 2.54,-135.38 | DD23.16 15.24,-135.38 | DD24.16 27.94,-137.92 | DD28.16 78.74,-137.92 | DD27.16 66.04,-137.92 | DD26.16 53.34,-137.92 | DD25.16 40.64,-137.92 | DD15.8 58.42,-96.01 | DD16.8 45.72,-96.01 | DD17.8 33.02,-96.01 | DD18.8 20.32,-96.01
  Bottom 1.422: DD104.16 -48.26,-135.38 | DD102.16 -22.86,-135.38 | DD103.16 -35.56,-135.38
  Bottom 1.93: 78.74,-137.92 66.04,-137.92 53.34,-137.92 40.64,-137.92 27.94,-137.92 15.24,-135.38 2.54,-135.38 -10.16,-135.38 -22.86,-135.38 -35.56,-135.38 -48.26,-135.38 | 67.31,-96.01 58.42,-96.01 45.72,-96.01 33.02,-96.01 20.32,-96.01 17.78,-96.01
GO  (1 unrouted)
  Bottom 0.406: DD108.4 XRG.4 XRG.3 | DD103.14 -36.83,-145.54 -38.1,-144.27 -49.53,-144.27 -52.07,-141.73 -57.15,-141.73 XRG1.4 XRG1.3
K1  (3 unrouted)
K2  (2 unrouted)
K3  (2 unrouted)
K4  (2 unrouted)
K5  (3 unrouted)
K6  (4 unrouted)
K7  (1 unrouted)
K8  (2 unrouted)
K9  (2 unrouted)
K10  (2 unrouted)
K11  (2 unrouted)
K12  (2 unrouted)
K13  (2 unrouted)
K14  (2 unrouted)
K15  (2 unrouted)
K16  (2 unrouted)
K17  (2 unrouted)
K18  (2 unrouted)
K19  (2 unrouted)
K20  (2 unrouted)
K21  (2 unrouted)
K27  (1 unrouted)
LED  (1 unrouted)
MA0
  Top 0.406: DD15.7 60.96,-92.2 62.23,-93.47 57.15,-136.65 55.88,-139.19 55.88,-148.08 59.69,-150.62 DD27.5
  Bottom 0.406: DD28.5 67.31,-151.89 64.77,-151.89 62.23,-150.62 DD27.5 54.61,-151.89 52.07,-151.89 49.53,-150.62 DD26.5 41.91,-151.89 39.37,-151.89 36.83,-150.62 DD25.5 29.21,-151.89 26.67,-151.89 24.13,-150.62 DD24.5 16.51,-151.89 13.97,-151.89 11.43,-150.62 DD23.5 3.81,-151.89 1.27,-151.89 -1.27,-150.62 DD22.5 -8.89,-151.89 -11.43,-151.89 -13.97,-150.62 DD21.5 -21.59,-151.89 -24.13,-151.89 -26.67,-150.62 DD102.5 -34.29,-151.89 -36.83,-151.89 -39.37,-150.62 DD103.5 -46.99,-151.89 -49.53,-151.89 -52.07,-150.62 DD104.5
MA1
  Top 0.406: DD15.9 60.96,-154.43 DD27.7
  Bottom 0.406: DD28.7 67.31,-156.97 64.77,-156.97 62.23,-155.7 DD27.7 54.61,-156.97 52.07,-156.97 49.53,-155.7 DD26.7 41.91,-156.97 39.37,-156.97 36.83,-155.7 DD25.7 29.21,-156.97 26.67,-156.97 24.13,-155.7 DD24.7 16.51,-156.97 13.97,-156.97 11.43,-155.7 DD23.7 3.81,-156.97 1.27,-156.97 -1.27,-155.7 DD22.7 -8.89,-156.97 -11.43,-156.97 -13.97,-155.7 DD21.7 -21.59,-156.97 -24.13,-156.97 -26.67,-155.7 DD102.7 -34.29,-156.97 -36.83,-156.97 -39.37,-155.7 DD103.7 -46.99,-156.97 -49.53,-156.97 -52.07,-155.7 DD104.7
MA2  (1 unrouted)
  Top 0.406: DD16.7 49.53,-92.2 48.26,-98.55 53.34,-132.84 50.8,-135.38 49.53,-151.89
  Bottom 0.406: DD28.6 67.31,-154.43 64.77,-154.43 62.23,-153.16 DD27.6 54.61,-154.43 52.07,-154.43 49.53,-153.16 DD26.6 41.91,-154.43 39.37,-154.43 36.83,-153.16 DD25.6 29.21,-154.43 26.67,-154.43 24.13,-153.16 DD24.6 16.51,-154.43 13.97,-154.43 11.43,-153.16 DD23.6 3.81,-154.43 1.27,-154.43 -1.27,-153.16 DD22.6 -8.89,-154.43 -11.43,-154.43 -13.97,-153.16 DD21.6 -21.59,-154.43 -24.13,-154.43 -26.67,-153.16 DD102.6 -34.29,-154.43 -36.83,-154.43 -39.37,-153.16 DD103.6 -46.99,-154.43 -49.53,-154.43 -52.07,-153.16 DD104.6
MA3  (1 unrouted)
  Top 0.406: DD16.9 54.61,-93.47 57.15,-96.01 54.61,-134.11 50.8,-140.46 50.8,-148.84 50.04,-149.61
  Bottom 0.406: DD28.12 77.47,-150.62 74.93,-149.35 69.85,-149.35 DD27.12 64.77,-150.62 62.23,-149.35 57.15,-149.35 DD26.12 52.07,-150.62 49.53,-149.35 44.45,-149.35 DD25.12 39.37,-150.62 36.83,-149.35 31.75,-149.35 DD24.12 26.67,-150.62 24.13,-149.35 19.05,-149.35 DD23.12 13.97,-150.62 11.43,-149.35 6.35,-149.35 DD22.12 1.27,-150.62 -1.27,-149.35 -6.35,-149.35 DD21.12 -11.43,-150.62 -13.97,-149.35 -19.05,-149.35 DD102.12 -24.13,-150.62 -26.67,-149.35 -31.75,-149.35 DD103.12 -36.83,-150.62 -39.37,-149.35 -44.45,-149.35 DD104.12
MA4  (1 unrouted)
  Top 0.406: DD17.7 35.56,-99.82 36.83,-103.63 39.37,-107.44 38.1,-117.6 38.1,-130.3 36.83,-132.84 35.56,-149.35
  Bottom 0.406: DD28.11 77.47,-153.16 74.93,-151.89 69.85,-151.89 DD27.11 64.77,-153.16 62.23,-151.89 57.15,-151.89 DD26.11 52.07,-153.16 49.53,-151.89 44.45,-151.89 DD25.11 39.37,-153.16 36.83,-151.89 31.75,-151.89 DD24.11 26.67,-153.16 24.13,-151.89 19.05,-151.89 DD23.11 13.97,-153.16 11.43,-151.89 6.35,-151.89 DD22.11 1.27,-153.16 -1.27,-151.89 -6.35,-151.89 DD21.11 -11.43,-153.16 -13.97,-151.89 -19.05,-151.89 DD102.11 -24.13,-153.16 -26.67,-151.89 -31.75,-151.89 DD103.11 -36.83,-153.16 -39.37,-151.89 -44.45,-151.89 DD104.11
MA5  (1 unrouted)
  Top 0.406: DD17.9 40.64,-98.55 41.91,-101.09 48.26,-132.84 48.26,-154.43
  Bottom 0.406: DD28.10 77.47,-155.7 74.93,-154.43 69.85,-154.43 DD27.10 64.77,-155.7 62.23,-154.43 57.15,-154.43 DD26.10 52.07,-155.7 49.53,-154.43 44.45,-154.43 DD25.10 39.37,-155.7 36.83,-154.43 31.75,-154.43 DD24.10 26.67,-155.7 24.13,-154.43 19.05,-154.43 DD23.10 13.97,-155.7 11.43,-154.43 6.35,-154.43 DD22.10 1.27,-155.7 -1.27,-154.43 -6.35,-154.43 DD21.10 -11.43,-155.7 -13.97,-154.43 -19.05,-154.43 DD102.10 -24.13,-155.7 -26.67,-154.43 -31.75,-154.43 DD103.10 -36.83,-155.7 -39.37,-154.43 -44.45,-154.43 DD104.10
MA6  (1 unrouted)
  Top 0.406: DD18.7 21.59,-90.93 22.86,-89.66 22.86,-121.41 24.13,-120.14 21.59,-123.95 21.59,-131.57 19.05,-145.54
  Bottom 0.406: DD28.13 77.47,-148.08 74.93,-146.81 69.85,-146.81 DD27.13 64.77,-148.08 62.23,-146.81 57.15,-146.81 DD26.13 52.07,-148.08 49.53,-146.81 44.45,-146.81 DD25.13 39.37,-148.08 36.83,-146.81 31.75,-146.81 DD24.13 26.67,-148.08 24.13,-146.81 19.05,-146.81 DD23.13 13.97,-148.08 11.43,-146.81 6.35,-146.81 DD22.13 1.27,-148.08 -1.27,-146.81 -6.35,-146.81 DD21.13 -11.43,-148.08 -13.97,-146.81 -19.05,-146.81 DD102.13 -24.13,-148.08 -26.67,-146.81 -31.75,-146.81 DD103.13 -36.83,-148.08 -39.37,-146.81 -44.45,-146.81 DD104.13
MA7  (1 unrouted)
  Top 0.406: DD18.9 30.48,-93.47 31.75,-98.55 29.21,-107.44 26.67,-126.49 24.13,-159.51
  Bottom 0.406: DD28.9 77.47,-158.24 74.93,-156.97 69.85,-156.97 DD27.9 64.77,-158.24 62.23,-156.97 57.15,-156.97 DD26.9 52.07,-158.24 49.53,-156.97 44.45,-156.97 DD25.9 39.37,-158.24 36.83,-156.97 31.75,-156.97 DD24.9 26.67,-158.24 24.13,-156.97 19.05,-156.97 DD23.9 13.97,-158.24 11.43,-156.97 6.35,-156.97 DD22.9 -1.27,-156.97 -6.35,-156.97 DD21.9 -11.43,-158.24 -13.97,-156.97 -19.05,-156.97 DD102.9 -24.13,-158.24 -26.67,-156.97 -31.75,-156.97 DD103.9 -36.83,-158.24 -39.37,-156.97 -44.45,-156.97 DD104.9
MD0  (1 unrouted)
  Top 0.406: DD31.3 -3.81,-75.69 -2.54,-71.88 13.97,-71.88 DD34.18
  Bottom 0.406: DD21.2 DD21.14
MD1  (2 unrouted)
  Bottom 0.406: DD22.2 DD22.14
MD2  (1 unrouted)
  Top 0.406: DD34.11 12.7,-93.47 11.43,-92.2 0,-92.2 -2.54,-89.66 -6.35,-89.66 -7.62,-88.39 -7.62,-85.85 DD31.7
  Bottom 0.406: DD23.2 DD23.14
MD3  (1 unrouted)
  Top 0.406: DD34.16 11.43,-80.77 10.16,-82.04 0,-82.04 -2.54,-84.58 -2.54,-87.12 -3.81,-88.39 DD31.8
  Bottom 0.406: DD24.2 DD24.14
MD4  (1 unrouted)
  Top 0.406: DD34.15 11.43,-83.31 10.16,-84.58 6.35,-84.58 5.08,-85.85 5.08,-87.12 3.81,-88.39 DD31.13
  Bottom 0.406: DD25.2 DD25.14
MD5  (1 unrouted)
  Top 0.406: DD34.14 11.43,-85.85 10.16,-87.12 6.35,-87.12 3.81,-89.66 1.27,-89.66 0,-88.39 0,-85.85 DD31.14
  Bottom 0.406: DD26.2 DD26.14
MD6  (1 unrouted)
  Top 0.406: DD34.13 16.51,-88.39 17.78,-87.12 17.78,-80.77 16.51,-79.5 3.81,-79.5 DD31.17
  Bottom 0.406: DD27.2 DD27.14
MD7  (1 unrouted)
  Top 0.406: DD34.12 16.51,-90.93 19.05,-89.66 19.05,-78.23 16.51,-76.96 3.81,-76.96 DD31.18
  Bottom 0.406: DD28.2 DD28.14
MISO  (1 unrouted)
MOSI  (1 unrouted)
N$1  (1 unrouted)
N$2  (2 unrouted)
N$3  (2 unrouted)
N$4  (1 unrouted)
N$5  (2 unrouted)
N$6  (3 unrouted)
N$7  (2 unrouted)
N$8  (2 unrouted)
N$9  (1 unrouted)
N$10  (1 unrouted)
N$11  (1 unrouted)
N$12  (1 unrouted)
N$13  (1 unrouted)
N$14  (1 unrouted)
N$15  (1 unrouted)
N$16  (2 unrouted)
N$17  (1 unrouted)
N$19  (2 unrouted)
N$20  (1 unrouted)
N$21  (2 unrouted)
N$22  (2 unrouted)
N$23  (1 unrouted)
N$24  (1 unrouted)
N$25  (1 unrouted)
N$26  (2 unrouted)
N$27  (4 unrouted)
N$28  (1 unrouted)
N$29  (1 unrouted)
  Bottom 0.406: 93.98,-36.32 93.98,-38.86 91.57,-38.86 RD1.1 | 93.98,-36.32 DD2.15 | DD2.9 109.22,-36.32 106.68,-36.32 | 106.68,-36.32 DD2.10 | DD2.11 104.14,-36.32 | 104.14,-36.32 106.68,-36.32 | 104.14,-36.32 93.98,-36.32 | 91.44,-38.86 RD1.1 | RD1.1 DD2.1
N$31  (4 unrouted)
N$32  (1 unrouted)
N$33  (2 unrouted)
N$34  (1 unrouted)
N$35  (1 unrouted)
N$36  (1 unrouted)
N$37  (1 unrouted)
N$38  (6 unrouted)
N$40  (2 unrouted)
N$42  (3 unrouted)
N$43
  Bottom 0.406: DD108.2 -54.61,-73.15 -52.07,-75.69 -52.07,-78.23 -50.8,-79.5 -45.72,-79.5 -44.45,-80.77 DD109.2
N$44  (1 unrouted)
N$45
  Bottom 0.406: DD108.5 -52.07,-80.77 -50.8,-82.04 -45.72,-82.04 -44.45,-83.31 DD109.3
N$46
  Bottom 0.406: DD108.6 -52.07,-83.31 -50.8,-84.58 -45.72,-84.58 -44.45,-85.85 DD109.4
N$48  (1 unrouted)
N$50  (1 unrouted)
N$51  (1 unrouted)
N$52  (1 unrouted)
N$53  (2 unrouted)
N$54  (1 unrouted)
N$55  (1 unrouted)
N$56  (1 unrouted)
N$65  (1 unrouted)
N$66  (1 unrouted)
N$67  (1 unrouted)
N$69  (1 unrouted)
P1  (1 unrouted)
P2  (1 unrouted)
P3  (1 unrouted)
P4  (1 unrouted)
P5
  Bottom 0.406: DD112.40 DDX12B.1
P6
  Bottom 0.406: DD112.39 DDX12B.2
P7
  Bottom 0.406: DD112.38 DDX12B.3
P8
  Bottom 0.406: DD112.37 DDX12B.4
P9  (1 unrouted)
P10  (1 unrouted)
P11  (1 unrouted)
P12  (1 unrouted)
P13  (1 unrouted)
P14  (1 unrouted)
P15  (1 unrouted)
P16  (2 unrouted)
P17  (2 unrouted)
P18  (2 unrouted)
P19  (2 unrouted)
P20  (2 unrouted)
P21  (2 unrouted)
P22  (2 unrouted)
P23  (2 unrouted)
P24  (2 unrouted)
PS2C  (2 unrouted)
PS2D  (2 unrouted)
Q3  (1 unrouted)
  Bottom 0.406: DD109.6 -39.37,-90.93 -38.1,-92.2 -33.02,-92.2 -31.75,-90.93 DD32.6 -26.67,-90.93 -25.4,-92.2 -20.32,-92.2 -19.05,-90.93 DD33.6
R  (3 unrouted)
  Top 0.406: DD102.2 -29.21,-143 -27.94,-141.73 XR2.1
  Bottom 0.406: DD3011.1.10 DD30.10 | XR2.1 XR2.2
R2  (1 unrouted)
  Bottom 0.406: DD33.8 -13.97,-93.47 -15.24,-92.2 -19.05,-92.2 -20.32,-93.47 DD32.8 -26.67,-93.47 -27.94,-92.2 -31.75,-92.2 -33.02,-93.47 DD109.8 -39.37,-93.47 -40.64,-92.2 -45.72,-92.2 -45.72,-89.66 -40.64,-89.66 -40.64,-79.5 -41.91,-78.23 DD109.1
RD  (2 unrouted)
RES  (4 unrouted)
RO  (1 unrouted)
  Top 0.406: DD102.14 -24.13,-144.27 -49.53,-144.27 -52.07,-141.73 -57.15,-141.73 XRG1.2
  Bottom 0.406: DD108.3 XRG.2 XRG.1 | XRG1.1 XRG1.2
ROMDD39  (5 unrouted)
SCK  (1 unrouted)
SND  (1 unrouted)
SNY  (1 unrouted)
STRT  (2 unrouted)
TON  (3 unrouted)
U7  (1 unrouted)
VCC  (4 unrouted)
VD0  (1 unrouted)
VD1  (1 unrouted)
  Bottom 0.406: DD32.3 -25.4,-83.31 -24.13,-84.58 -21.59,-84.58 -19.05,-82.04 -13.97,-82.04
VD2  (1 unrouted)
  Bottom 0.406: DD32.4 -26.67,-85.85 -25.4,-87.12 -21.59,-87.12 -20.32,-85.85
VD3  (1 unrouted)
  Bottom 0.406: DD32.5 -25.4,-88.39 -24.13,-89.66 -21.59,-89.66 -20.32,-88.39
VD4  (1 unrouted)
VD5
  Bottom 0.406: DD33.3 -13.97,-83.31 -12.7,-82.04 -2.54,-82.04 0,-79.5 3.81,-79.5 5.08,-80.77 5.08,-82.04 3.81,-83.31 DD31.15
VD6
  Bottom 0.406: DD33.4 -13.97,-85.85 -12.7,-84.58 -3.81,-84.58 0,-80.77 DD31.16
VD7
  Bottom 0.406: DD33.5 -13.97,-88.39 -12.7,-87.12 3.81,-87.12 5.08,-85.85 5.08,-74.42 3.81,-73.15 DD31.19
VID  (6 unrouted)
  Bottom 0.406: -64.77,-112.52 139.7,-112.52 139.7,-27.43
(copper drawn outside any net)
  shapes: Top area x2

## Text on the board
bPlace: 220х135 вост экс нов | 21x13